# Altium schematic sheet ARDUINO_DUE_Ms.schdoc
size 158 x 93 mm
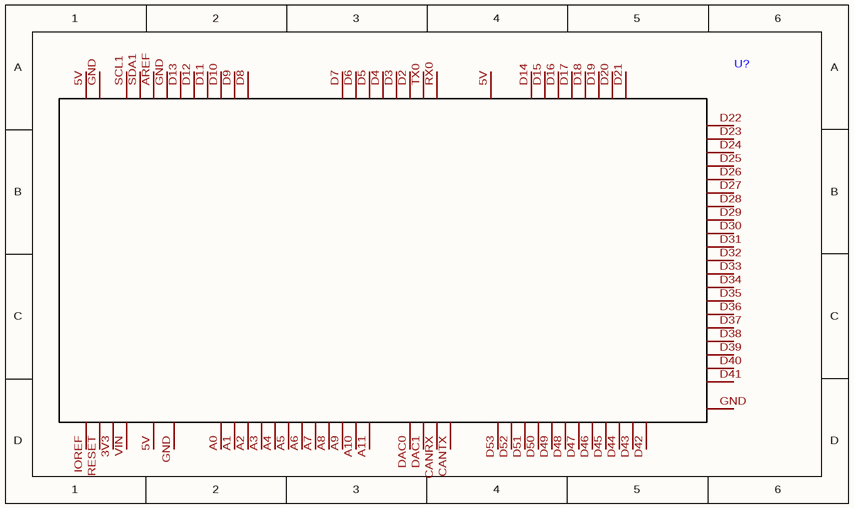
[diagram p0: ARDUINO_DUE_Ms.schdoc]

## Parts
U?  (no value)  [ARDUINO_DUE]

## Nets

Not connected (* = marked no-connect by the designer): U? 3V3 5V A0 A1 A2 A3 A4 A5 A6 A7 A8 A9 A10 A11 AREF CANRX CANTX D2 D3 D4 D5 D6 D7 D8 D9 D10 D11 D12 D13 D14 D15 D16 D17 D18 D19 D20 D21 D22 D23 D24 D25 D26 D27 D28 D29 D30 D31 D32 D33 D34 D35 D36 D37 D38 D39 D40 D41 D42 D43 D44 D45 D46 D47 D48 D49 D50 D51 D52 D53 DAC0 DAC1 GND IOREF RESET RX0 SCL1 SDA1 TX0 VIN

## Library data of the parts
U? = ARDUINO_DUE